# EAGLE design ArduinoParser (EAGLE 9.4.2)
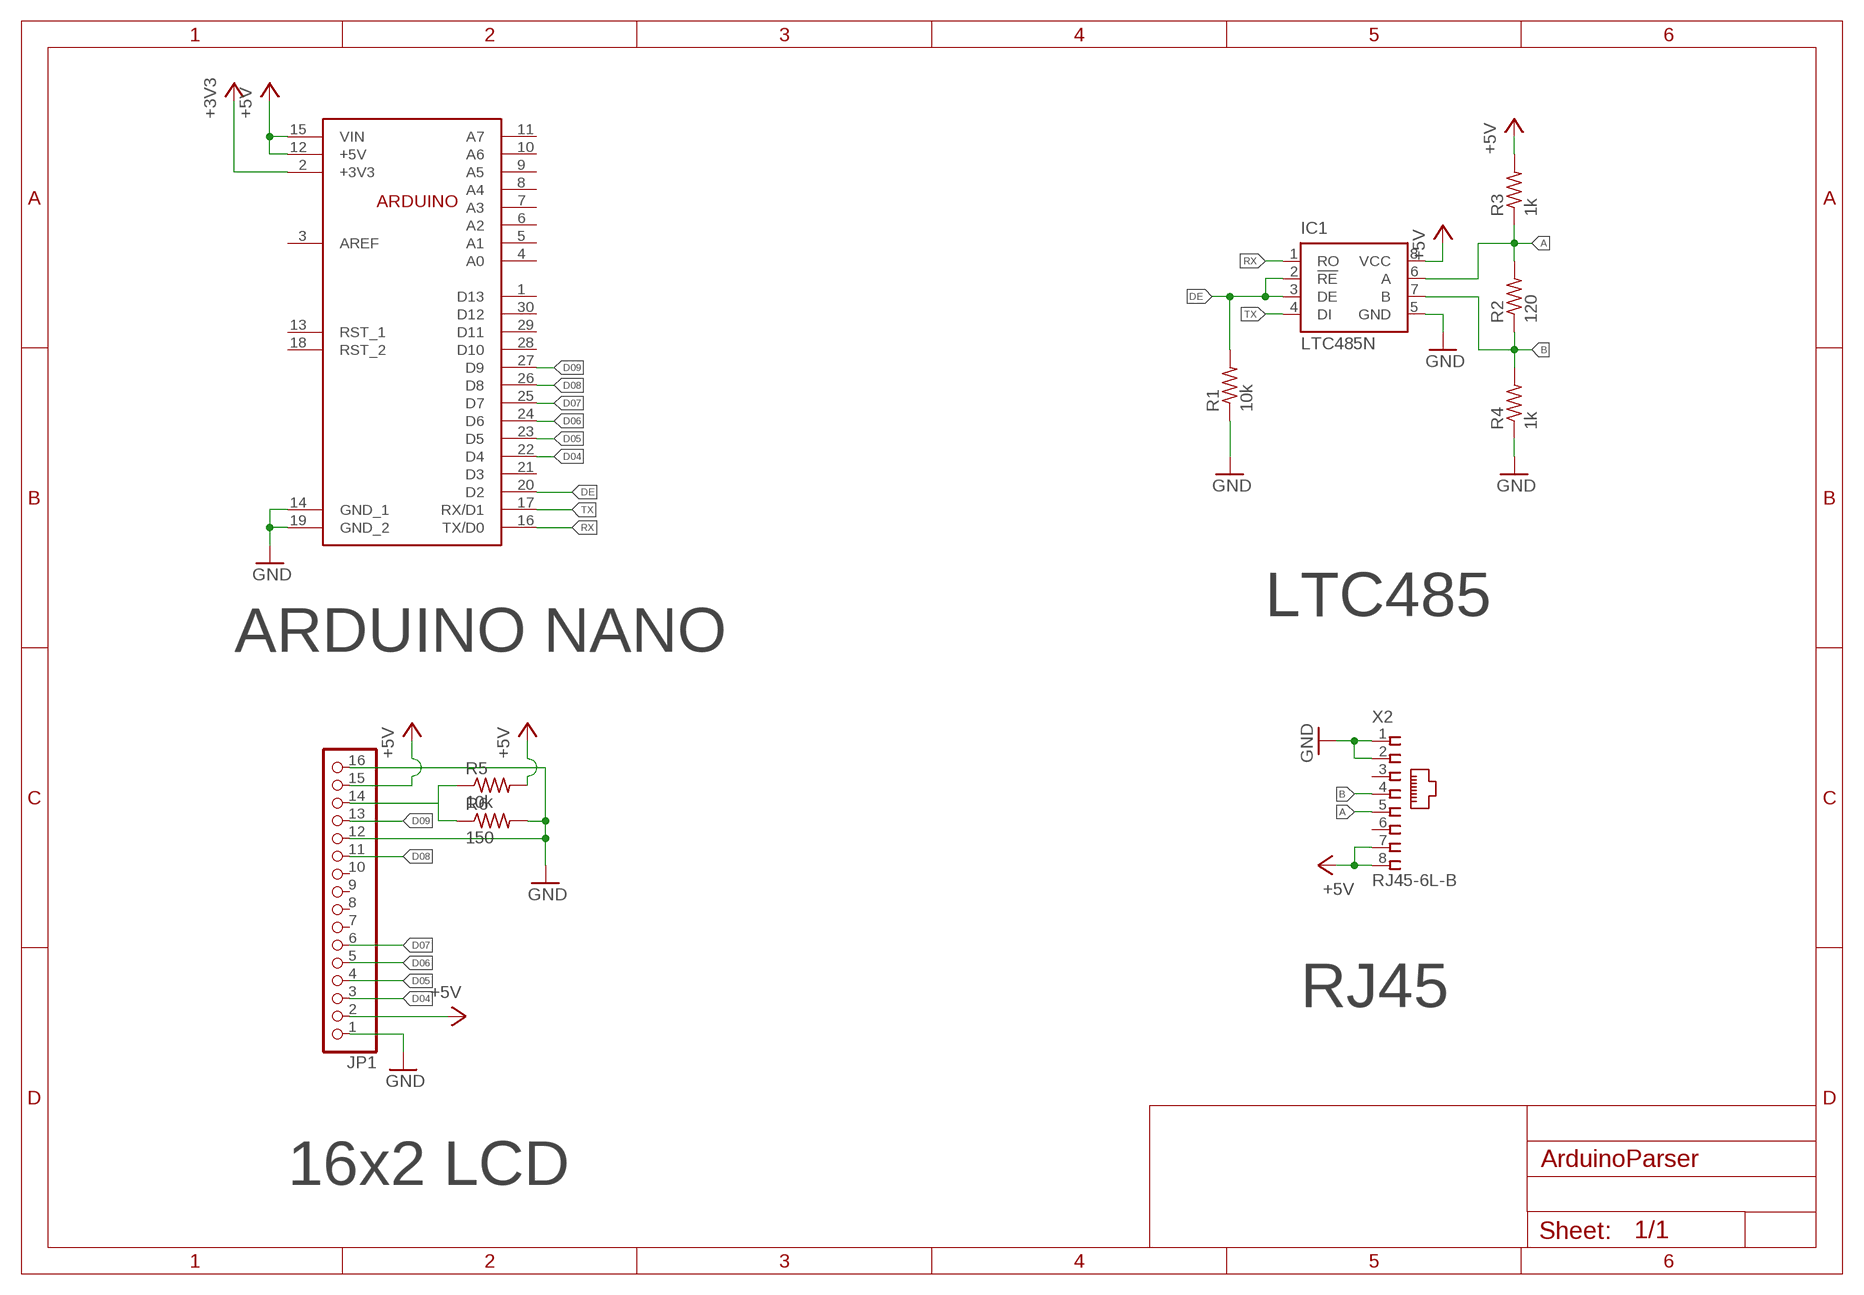
[diagram p0: schematic, sheet 1]

## Parts
IC1  LTC485N  [DIL08]
JP1  PINHD-1X16  [1X16]
R1  10k  R-US_0204/7  [0204/7]
R2  120  R-US_0204/7  [0204/7]
R3  1k  R-US_0204/7  [0204/7]
R4  1k  R-US_0204/7  [0204/7]
R5  10k  R-US_0204/7  [0204/7]
R6  150  R-US_0204/7  [0204/7]
U$2  ARDUINONANO  [ARDUINO]
X2  RJ45-6L-B  [RJ45-NO-SHIELD]

## Nets
+3V3: U$2.2(+3V3)
+5V: IC1.8(VCC) JP1.2 JP1.15 R3.2 R5.2 U$2.12(+5V) U$2.15(VIN) X2.7 X2.8
A: IC1.6(A) R2.2 R3.1 X2.5
B: IC1.7(B) R2.1 R4.2 X2.4
D04: JP1.3 U$2.22(D4)
D05: JP1.4 U$2.23(D5)
D06: JP1.5 U$2.24(D6)
D07: JP1.6 U$2.25(D7)
D08: JP1.11 U$2.26(D8)
D09: JP1.13 U$2.27(D9)
DE: IC1.2(!RE) IC1.3(DE) R1.2 U$2.20(D2)
GND: IC1.5(GND) JP1.1 JP1.12 JP1.16 R1.1 R4.1 R6.2 U$2.14(GND_1) U$2.19(GND_2) X2.1 X2.2
N$21: JP1.14 R5.1 R6.1
RX: IC1.1(RO) U$2.16(TX/D0)
TX: IC1.4(DI) U$2.17(RX/D1)
Unconnected: JP1.7 JP1.8 JP1.9 JP1.10 U$2.1(D13) U$2.3(AREF) U$2.4(A0) U$2.5(A1) U$2.6(A2) U$2.7(A3) U$2.8(A4) U$2.9(A5) U$2.10(A6) U$2.11(A7) U$2.13(RST_1) U$2.18(RST_2) U$2.21(D3) U$2.28(D10) U$2.29(D11) U$2.30(D12) X2.3 X2.6

## Notes on the sheet
- LTC485
- ARDUINO NANO
- RJ45
- 16x2 LCD

## Library data of the parts
IC1 = linear-technology:LTC485: Low Power RS485 Interface Transceiver Source: http://www.linear.com/pc/downloadDocument.do?navId=H0,C1,C1007,C1017,P2064,D1718; OC_FARNELL: unknown; OC_NEWARK: unknown
JP1 = pinhead:PINHD-1X16: PIN HEADER
R1-R6 = rcl:R-US_: RESISTOR, American symbol; SPICEPREFIX: R
U$2 = EzerLonginus:ARDUINO
X2 = con-tycoelectronics:RJ45: CORCOM Modular RJ Jacks No Shield Source: www.tycoelectronics.com .. ENG_DS_1654001_1099_RJ_L_0507.pdf; MPN: RJ45-6L-B; OC_FARNELL: unknown; OC_NEWARK: 16R6090

## Board
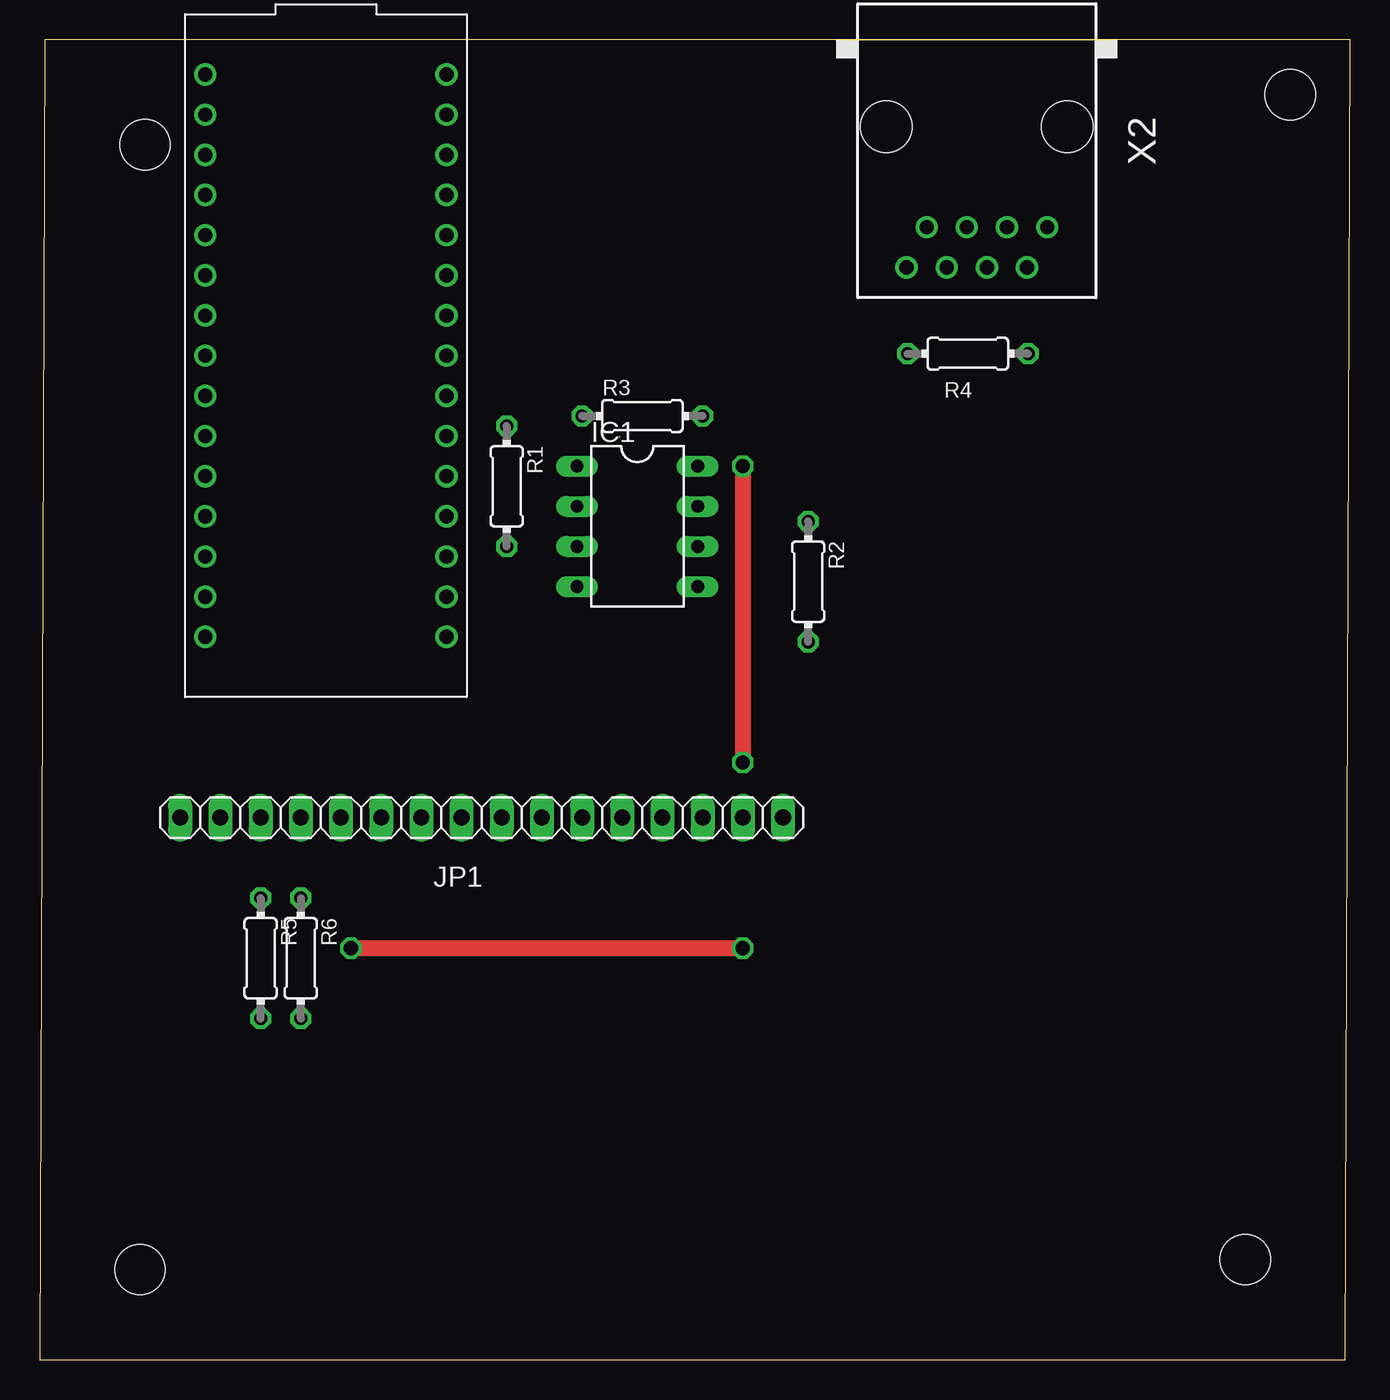
[diagram p1: board, top side]
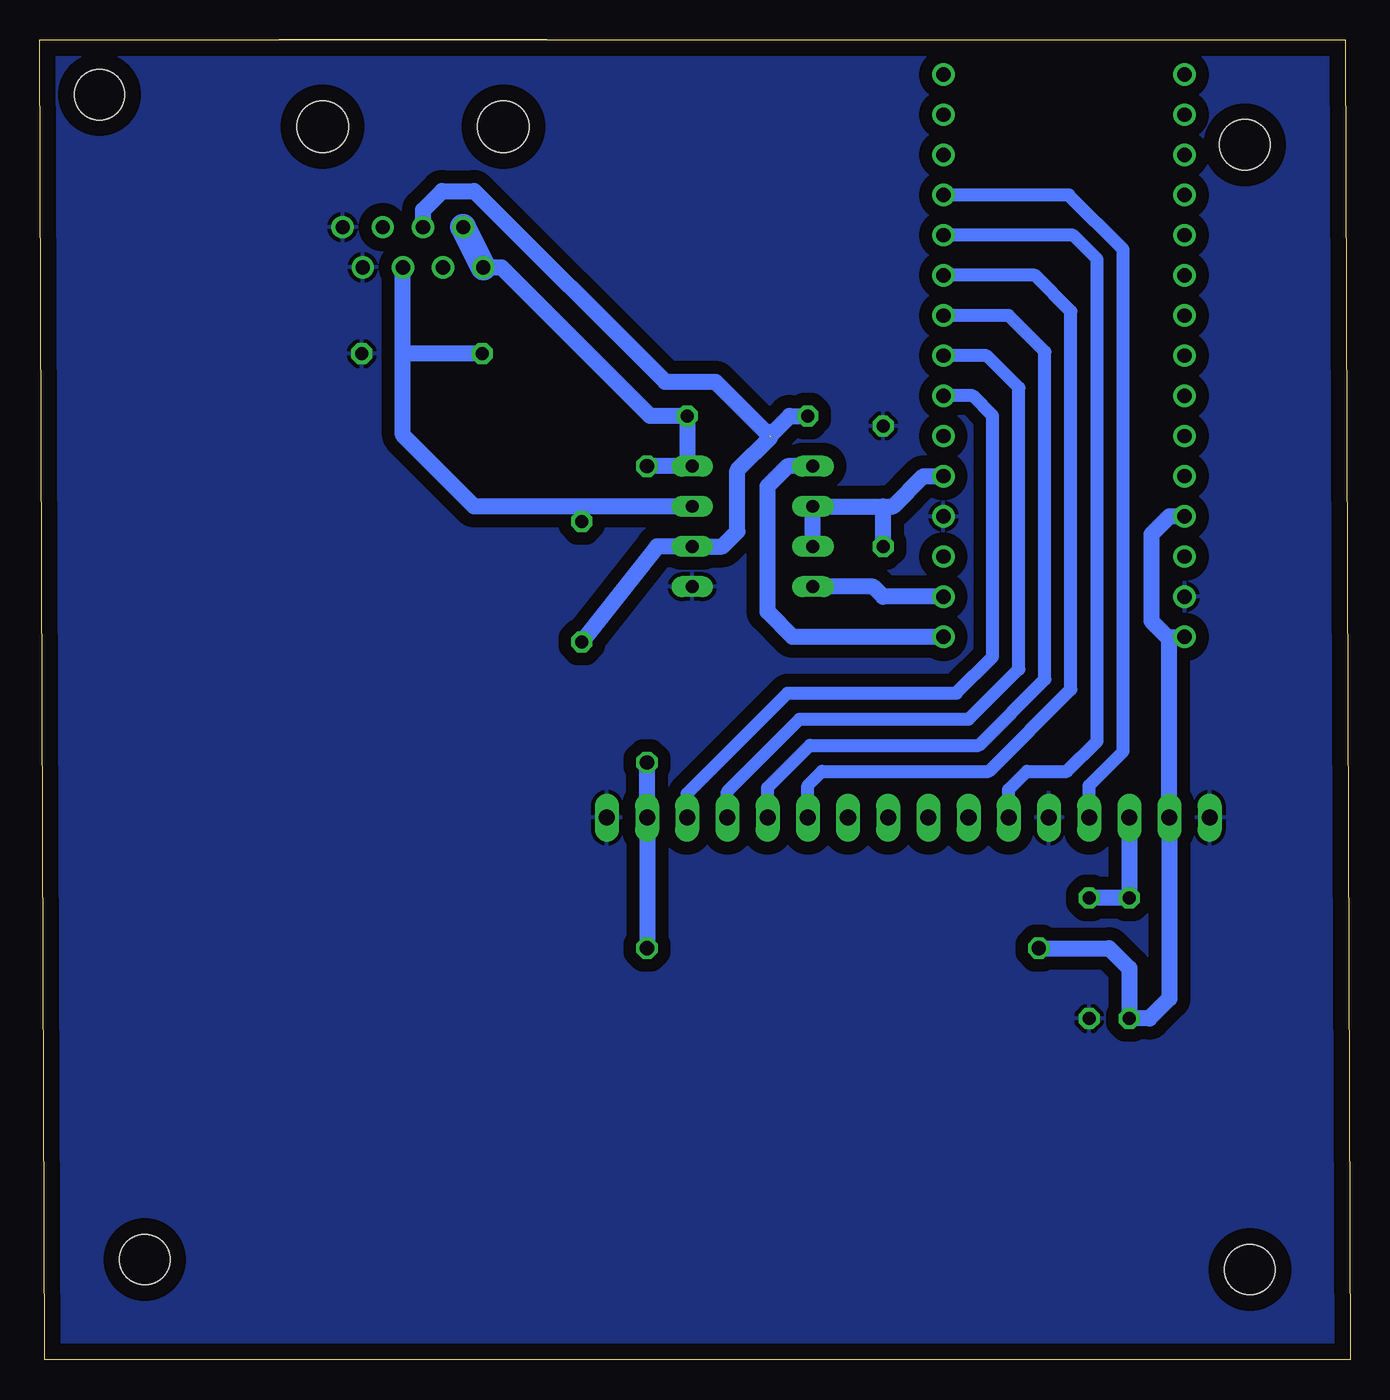
[diagram p2: board, bottom side, seen from below]

Size 82.85 x 83.49 mm. Coordinates in mm from the lower left corner, seen from the top.
Outline: 0,0 82.53,0 82.85,83.49 0.32,83.49 0,0
Copper layers (1*16): Top 0.035mm / dielectric 1.5mm / Bottom 0.035mm
Design rules "default": minimum track width 6mil, minimum drill 0.35mm, track to track 6mil, track to pad 6mil, pad to pad 6mil, via to via 6mil, smd to smd 6mil, copper to edge 40mil, drill to drill 6mil, minimum pad ring 10mil, minimum via ring 8mil, stop-mask expansion 4mil, vias tented up to drill 0mil, thermal gap 10mil
Holes 3.17 mm at 6.67,76.83 79.06,80.01 76.2,6.35 6.35,5.71

### Footprints (pad centres in the part's own frame; a part is rotated, then mirrored left to right if it is on the bottom)
DIL08 = drill 0.813 long: 1 -3.81,-3.81; 2 -1.27,-3.81; 3 1.27,-3.81; 4 3.81,-3.81; 5 3.81,3.81; 6 1.27,3.81; 7 -1.27,3.81; 8 -3.81,3.81
1X16 = drill 1.016 long: 1 -19.05,0; 2 -16.51,0; 3 -13.97,0; 4 -11.43,0; 5 -8.89,0; 6 -6.35,0; 7 -3.81,0; 8 -1.27,0; 9 1.27,0; 10 3.81,0; 11 6.35,0; 12 8.89,0; 13 11.43,0; 14 13.97,0; 15 16.51,0; 16 19.05,0
0204/7 = drill 0.813 octagon: 1 -3.81,0; 2 3.81,0
ARDUINO = drill 0.9: 1 -7.62,16.51; 2 -7.62,13.97; 3 -7.62,11.43; 4 -7.62,8.89; 5 -7.62,6.35; 6 -7.62,3.81; 7 -7.62,1.27; 8 -7.62,-1.27; 9 -7.62,-3.81; 10 -7.62,-6.35; 11 -7.62,-8.89; 12 -7.62,-11.43; 13 -7.62,-13.97; 14 -7.62,-16.51; 15 -7.62,-19.05; 16 7.62,-19.05; 17 7.62,-16.51; 18 7.62,-13.97; 19 7.62,-11.43; 20 7.62,-8.89; 21 7.62,-6.35; 22 7.62,-3.81; 23 7.62,-1.27; 24 7.62,1.27; 25 7.62,3.81; 26 7.62,6.35; 27 7.62,8.89; 28 7.62,11.43; 29 7.62,13.97; 30 7.62,16.51
RJ45-NO-SHIELD = drill 0.9 pad 1.4: 1 -4.445,6.35; 2 -3.175,8.89; 3 -1.905,6.35; 4 -0.635,8.89; 5 0.635,6.35; 6 1.905,8.89; 7 3.175,6.35; 8 4.445,8.89 | hole 3.251: -5.715,0; 5.715,0

### Placement (x,y rotation side)
IC1  37.78,52.7 270 top
JP1  27.94,34.29 180 top
R1  29.53,55.24 270 top
R2  48.58,49.21 270 top
R3  38.1,59.69 0 top
R4  58.67,63.63 180 top
R5  13.97,25.4 270 top
R6  16.51,25.4 270 top
U$2  18.1,64.77 0 top
X2  59.25,77.98 180 top

### Tracks (layer width: path | path; a pad name or v marks a point on that pad's centre or on a via)
+5V  (via drill 0.9)
  Top 1.016: v44.45,26.04 v19.68,26.04 | v44.45,56.52 v44.45,37.78
  Bottom 1.016: v44.45,26.04 JP1.2 v44.45,37.78 | v19.68,26.04 15.24,26.04 13.97,24.77 R5.2 12.7,21.59 11.43,22.86 JP1.15 11.43,45.59 11.56,45.72 | X2.8 53.66,69.09 44.26,59.69 R3.2 41.91,56.83 IC1.8 v44.45,56.52 | U$2.12 11.43,53.34 12.57,52.2 12.57,46.74 11.56,45.72 | 11.56,45.72 U$2.15
  Bottom 1.651: X2.8 X2.7
A  (1 unrouted)
  Bottom 1.016: R3.1 35.43,59.69 36.7,58.42 36.7,58.67 | R2.2 43.81,51.44 IC1.6 39.69,51.44 38.73,52.39 38.73,56.26 36.64,58.36 40.13,61.85 43.31,61.85 55.37,73.91 57.4,73.91 58.61,72.71 X2.5
B
  Bottom 1.016: IC1.7 48.77,53.98 | 48.77,53.98 55.37,53.98 59.88,58.48 59.88,63.5 | 59.88,63.5 X2.4 | R4.2 59.75,63.63 59.88,63.5 | R2.1 48.58,53.78 48.77,53.98
D04
  Bottom 0.813: JP1.3 41.91,35.81 35.56,42.16 24.89,42.16 22.61,44.45 22.61,59.69 23.88,60.96 U$2.22
D05
  Bottom 0.813: JP1.4 39.37,35.94 34.8,40.51 24.13,40.51 20.95,43.69 20.95,61.47 22.99,63.5 U$2.23
D06
  Bottom 0.813: JP1.5 36.83,36.2 34.16,38.86 23.5,38.86 19.3,43.05 19.3,63.75 21.59,66.04 U$2.24
D07
  Bottom 0.813: JP1.6 34.29,36.32 33.4,37.21 22.86,37.21 17.65,42.42 17.65,66.29 19.94,68.58 U$2.25
D08
  Bottom 0.813: JP1.11 21.59,36.07 20.45,37.21 17.91,37.21 16,39.12 16,69.6 17.53,71.12 U$2.26
D09
  Bottom 0.813: U$2.27 17.78,73.66 14.35,70.23 14.35,38.48 16.51,36.32 JP1.13
DE
  Bottom 1.016: IC1.3 IC1.2 29.53,53.98 | 29.53,53.98 28.89,53.98 26.99,55.88 U$2.20 | R1.2 29.53,53.98
GND
  pour Bottom (isolate 0.813): 0.32,83.82 82.87,83.82 82.87,0 0.32,0
N$21
  Bottom 1.016: JP1.14 R5.1 R6.1
RX
  Bottom 1.016: U$2.16 35.24,45.72 36.83,47.31 36.83,55.24 35.56,56.52 IC1.1
TX
  Bottom 1.016: U$2.17 29.53,48.26 30.16,48.9 IC1.4